# Altium schematic sheet 32.SchDoc
size 513 x 386 mm
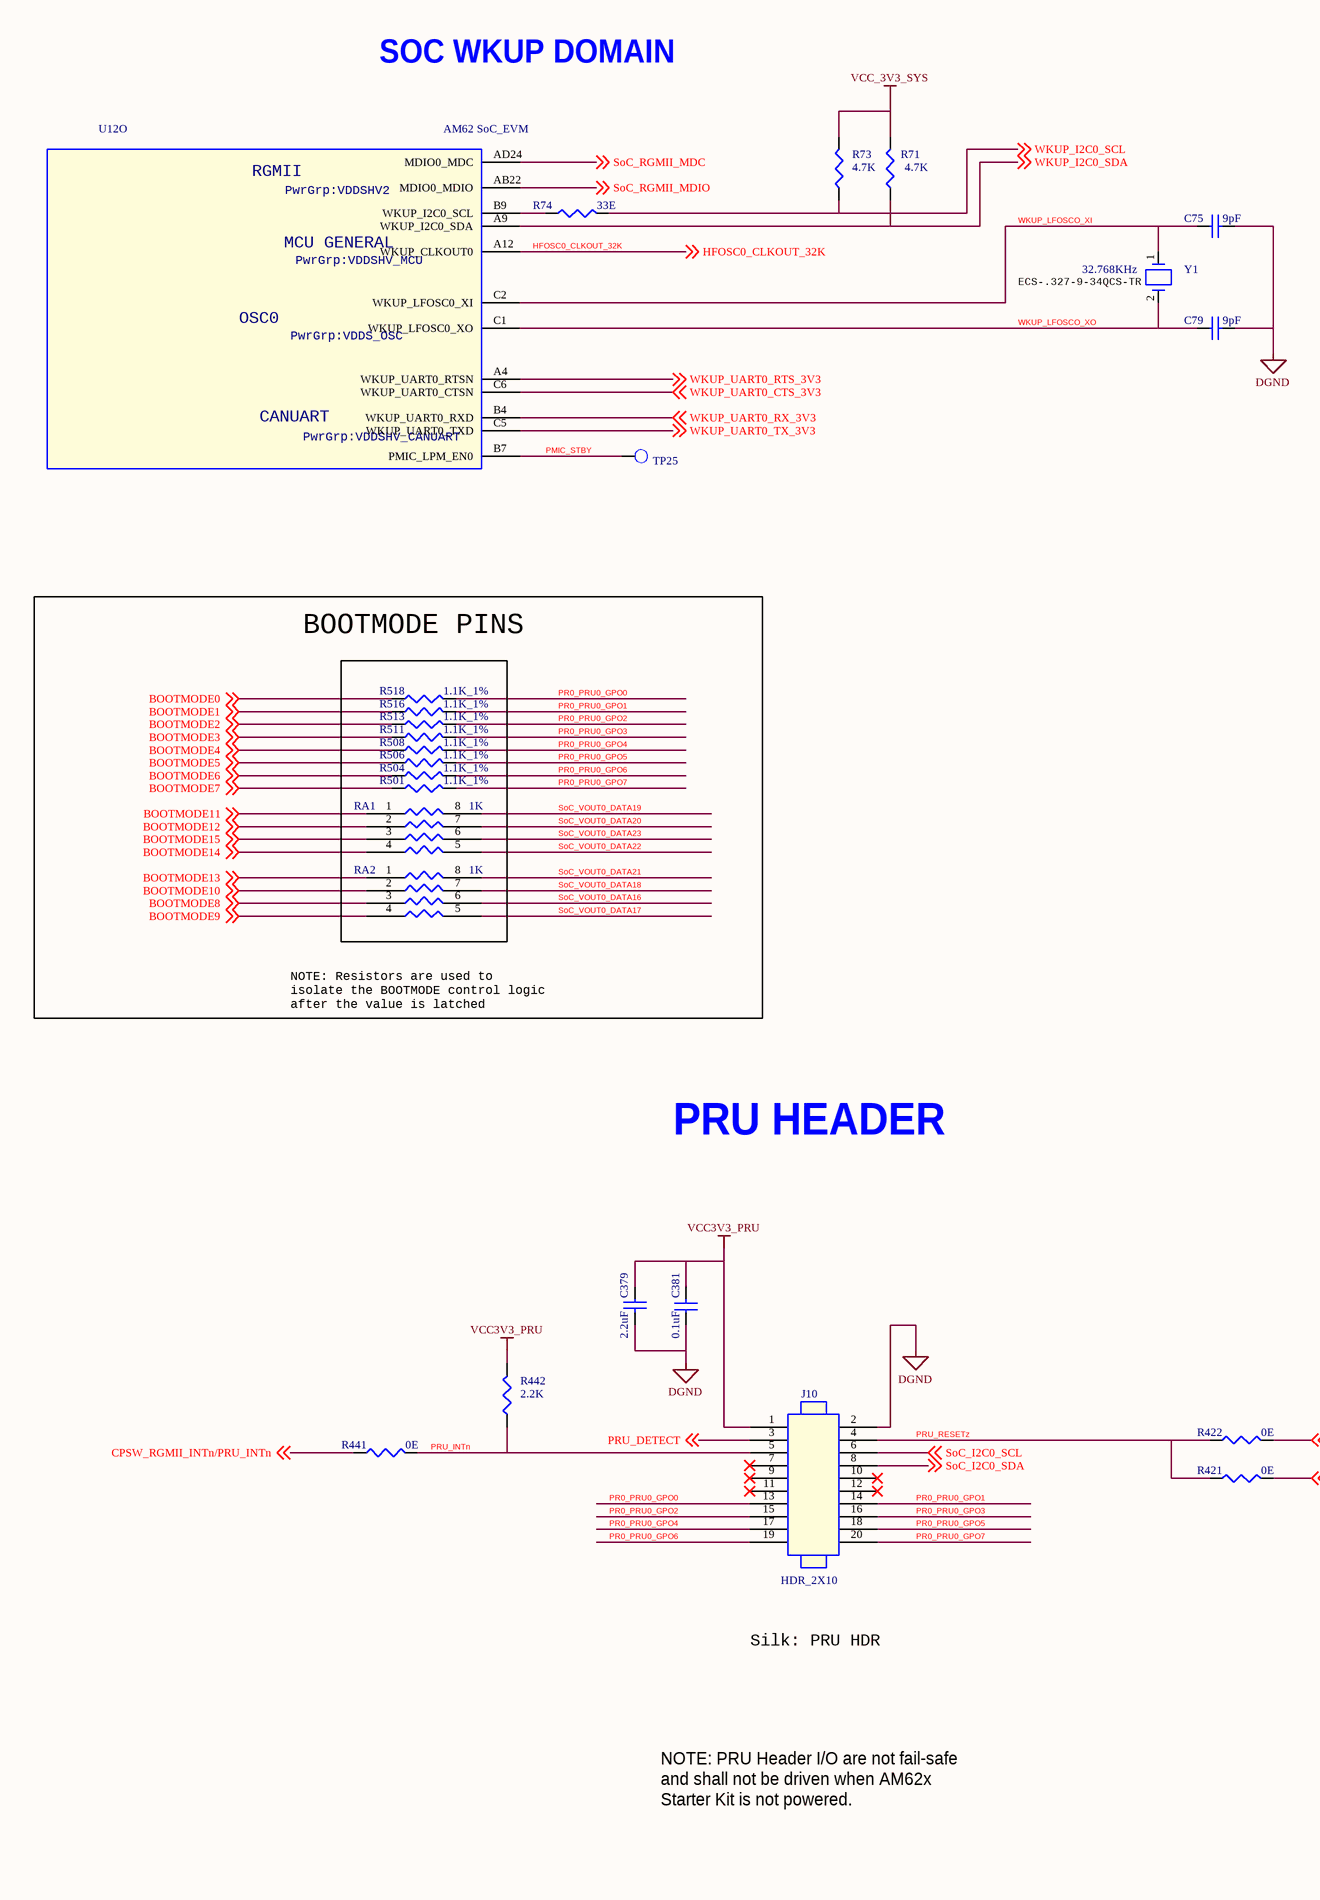
[diagram p0: 32.SchDoc, left]
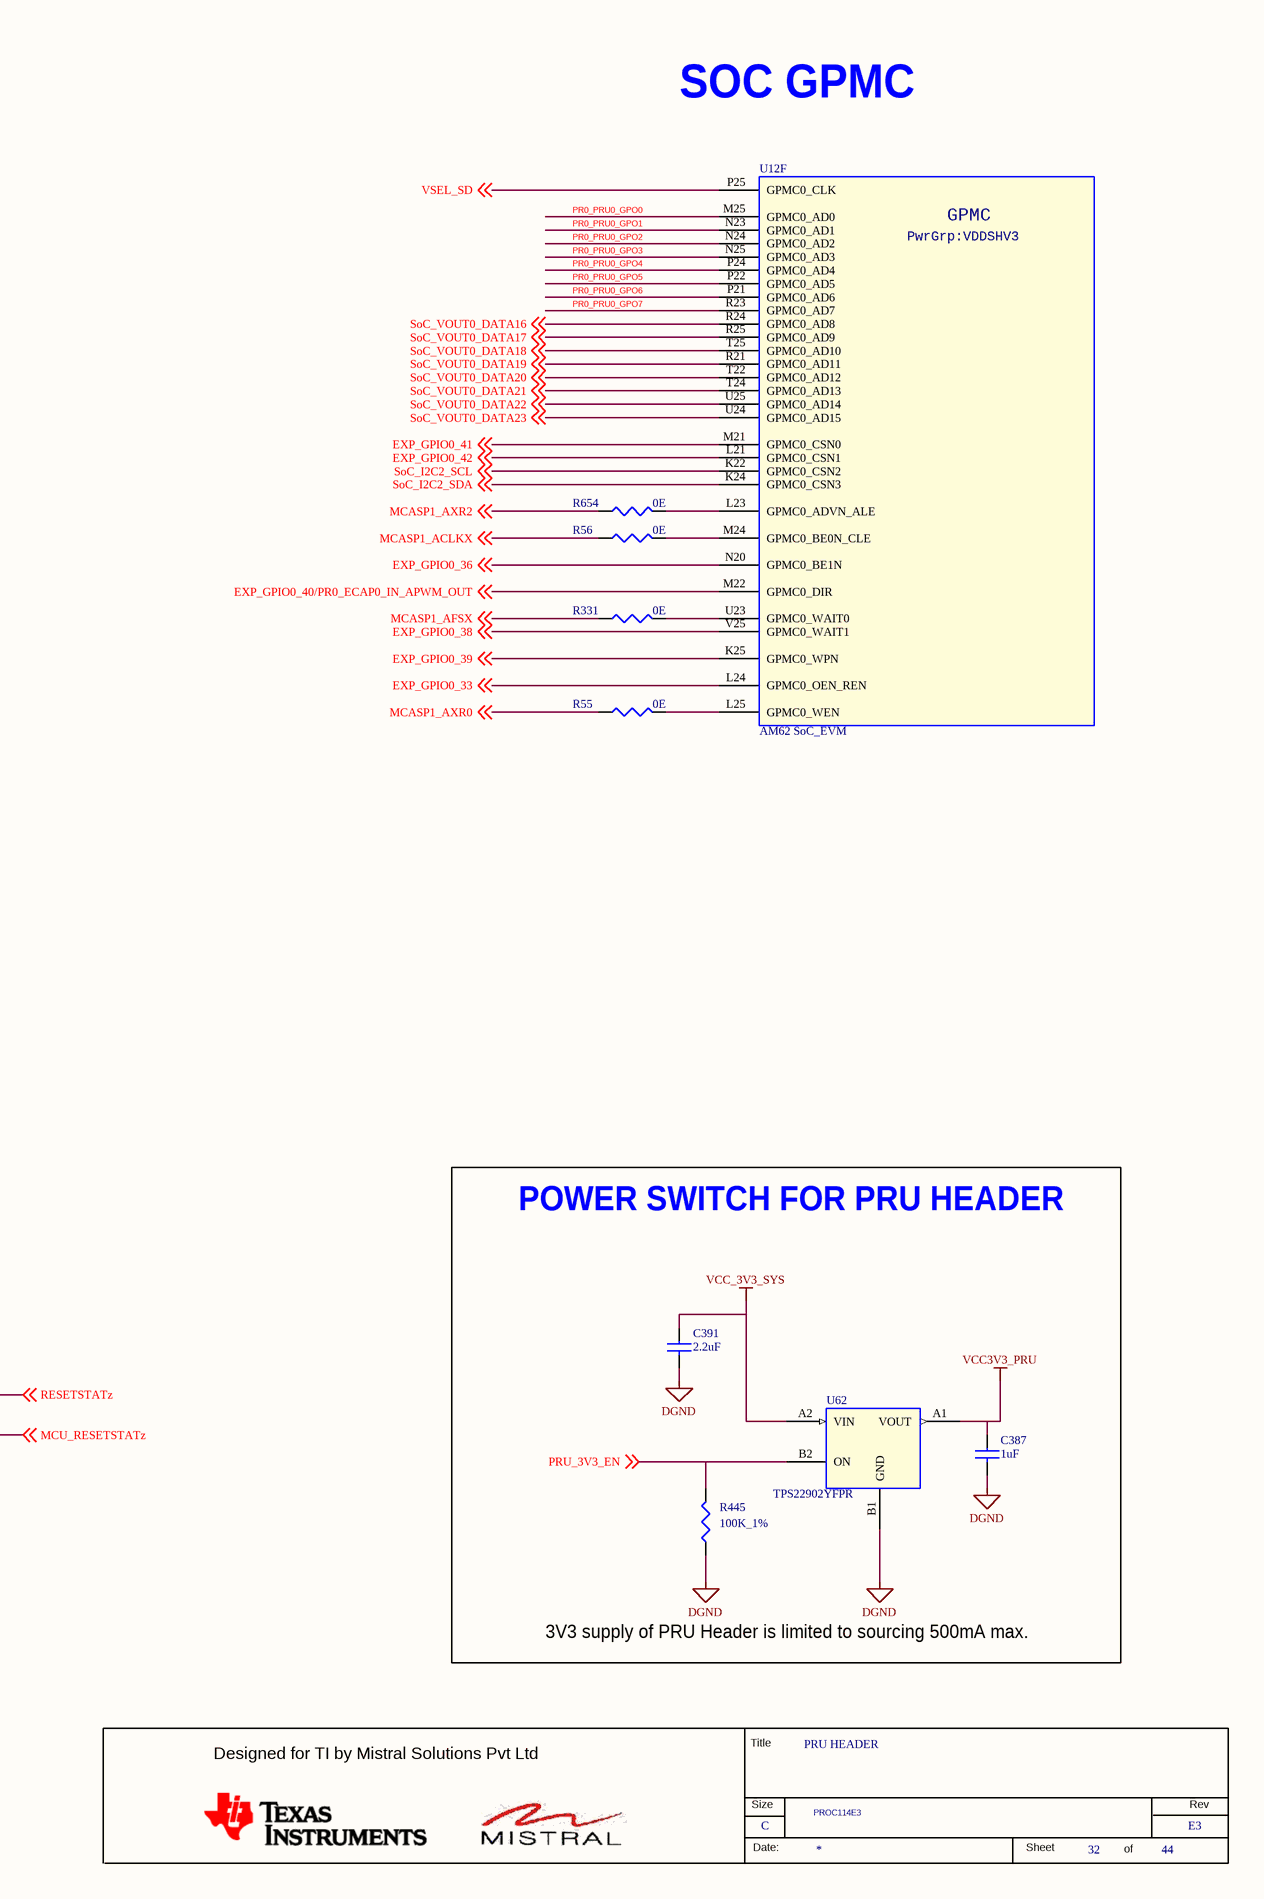
[diagram p1: 32.SchDoc, right]

## Parts
*  RevCode: E3  Title: PRU HEADER  Page Size: C  Page Number: 32  Page Count: 44  Variant Name: PROC114E3  (hidden comment: MISTRAL_TITLEBLK_CSIZE)  (graphical)
C75  9pF  [CAP0402_0-75]
C79  9pF  [CAP0402_0-75]
C379  2.2uF  [CAP0402_0-75]
C381  0.1uF  [CAP0201_0-5]
C387  1uF  [CAP0201_0-5]
C391  2.2uF  [CAP0402_0-75]
J10  HDR_2X10  [HDR_2X10_PREC010DAAN_S_T_8-4]
R55  0E  [RES0201_0-5]
R56  0E  [RES0201_0-5]
R71  4.7K  [RES0201_0-5]
R73  4.7K  [RES0201_0-5]
R74  33E  [RES0201_0-5]
R331  0E  [RES0201_0-5]
R421  0E  [RES0402_0-5]
R422  0E  [RES0201_0-5]
R441  0E  [RES0201_0-5]
R442  2.2K  [RES0201_0-5]
R445  100K_1%  [RES0402_0-5]
R501  1.1K_1%  [RES0201_0-5]
R504  1.1K_1%  [RES0201_0-5]
R506  1.1K_1%  [RES0201_0-5]
R508  1.1K_1%  [RES0201_0-5]
R511  1.1K_1%  [RES0201_0-5]
R513  1.1K_1%  [RES0201_0-5]
R516  1.1K_1%  [RES0201_0-5]
R518  1.1K_1%  [RES0201_0-5]
R654  0E  [RES0201_0-5]
RA1  1K  [RESA_EXB_0201-4_0-5]
RA2  1K  [RESA_EXB_0201-4_0-5]
TP25  TP20_SMD  [TP20_SMD]  (value not drawn)
U12  AM62 SoC_EVM  [BGA425_19-68_510X510_0-7]  (parts F,O of 18)
U62  TPS22902YFPR  [DSBGA4_15-74_30X30_0-5]
Y1  32.768KHz  [XTAL_ECS-32_130X60_SMD_0-9]

## Blocks framed on the sheet
BOOTMODE PINS: R501 R504 R506 R508 R511 R513 R516 R518 RA1 RA2
POWER SWITCH FOR PRU HEADER: C387 C391 R445 U62

## Nets
DGND: C75.2 C79.2 C379.2 C381.1 C387.2 C391.2 J10.2 R445.1 U62.B1(GND)
VCC3V3_PRU: C379.1 C381.2 C387.1 J10.1 R442.1 U62.A1(VOUT)
VCC_3V3_SYS: C391.1 R71.1 R73.1 U62.A2(VIN)
BOOTMODE0: R518.1 ; off-sheet BOOTMODE0
BOOTMODE1: R516.1 ; off-sheet BOOTMODE1
BOOTMODE2: R513.1 ; off-sheet BOOTMODE2
BOOTMODE3: R511.1 ; off-sheet BOOTMODE3
BOOTMODE4: R508.1 ; off-sheet BOOTMODE4
BOOTMODE5: R506.1 ; off-sheet BOOTMODE5
BOOTMODE6: R504.1 ; off-sheet BOOTMODE6
BOOTMODE7: R501.1 ; off-sheet BOOTMODE7
BOOTMODE8: RA2.3 ; off-sheet BOOTMODE8
BOOTMODE9: RA2.4 ; off-sheet BOOTMODE9
BOOTMODE10: RA2.2 ; off-sheet BOOTMODE10
BOOTMODE11: RA1.1 ; off-sheet BOOTMODE11
BOOTMODE12: RA1.2 ; off-sheet BOOTMODE12
BOOTMODE13: RA2.1 ; off-sheet BOOTMODE13
BOOTMODE14: RA1.4 ; off-sheet BOOTMODE14
BOOTMODE15: RA1.3 ; off-sheet BOOTMODE15
CPSW_RGMII_INTn/PRU_INTn: R441.1 ; off-sheet CPSW_RGMII_INTn/PRU_INTn
EXP_GPIO0_33: U12.L24(GPMC0_OEN_REN) ; off-sheet EXP_GPIO0_33
EXP_GPIO0_36: U12.N20(GPMC0_BE1N) ; off-sheet EXP_GPIO0_36
EXP_GPIO0_38: U12.V25(GPMC0_WAIT1) ; off-sheet EXP_GPIO0_38
EXP_GPIO0_39: U12.K25(GPMC0_WPN) ; off-sheet EXP_GPIO0_39
EXP_GPIO0_40/PR0_ECAP0_IN_APWM_OUT: U12.M22(GPMC0_DIR) ; off-sheet EXP_GPIO0_40/PR0_ECAP0_IN_APWM_OUT
EXP_GPIO0_41: U12.M21(GPMC0_CSN0) ; off-sheet EXP_GPIO0_41
EXP_GPIO0_42: U12.L21(GPMC0_CSN1) ; off-sheet EXP_GPIO0_42
HFOSC0_CLKOUT_32K: U12.A12(WKUP_CLKOUT0) ; off-sheet HFOSC0_CLKOUT_32K
MCASP1_ACLKX: R56.1 ; off-sheet MCASP1_ACLKX
MCASP1_AFSX: R331.1 ; off-sheet MCASP1_AFSX
MCASP1_AXR0: R55.1 ; off-sheet MCASP1_AXR0
MCASP1_AXR2: R654.1 ; off-sheet MCASP1_AXR2
MCU_RESETSTATz: R421.1 ; off-sheet MCU_RESETSTATz
PMIC_STBY: TP25.1(TP) U12.B7(PMIC_LPM_EN0)
PR0_PRU0_GPO0: J10.13 R518.2 U12.M25(GPMC0_AD0)
PR0_PRU0_GPO1: J10.14 R516.2 U12.N23(GPMC0_AD1)
PR0_PRU0_GPO2: J10.15 R513.2 U12.N24(GPMC0_AD2)
PR0_PRU0_GPO3: J10.16 R511.2 U12.N25(GPMC0_AD3)
PR0_PRU0_GPO4: J10.17 R508.2 U12.P24(GPMC0_AD4)
PR0_PRU0_GPO5: J10.18 R506.2 U12.P22(GPMC0_AD5)
PR0_PRU0_GPO6: J10.19 R504.2 U12.P21(GPMC0_AD6)
PR0_PRU0_GPO7: J10.20 R501.2 U12.R23(GPMC0_AD7)
PRU_3V3_EN: R445.2 U62.B2(ON) ; off-sheet PRU_3V3_EN
PRU_DETECT: J10.3 ; off-sheet PRU_DETECT
PRU_INTn: J10.5 R441.2 R442.2
PRU_RESETz: J10.4 R421.2 R422.2
RESETSTATz: R422.1 ; off-sheet RESETSTATz
SoC_I2C0_SCL: J10.6 ; off-sheet SoC_I2C0_SCL
SoC_I2C0_SDA: J10.8 ; off-sheet SoC_I2C0_SDA
SoC_I2C2_SCL: U12.K22(GPMC0_CSN2) ; off-sheet SoC_I2C2_SCL
SoC_I2C2_SDA: U12.K24(GPMC0_CSN3) ; off-sheet SoC_I2C2_SDA
SoC_RGMII_MDC: U12.AD24(MDIO0_MDC) ; off-sheet SoC_RGMII_MDC
SoC_RGMII_MDIO: U12.AB22(MDIO0_MDIO) ; off-sheet SoC_RGMII_MDIO
SoC_VOUT0_DATA16: RA2.6 U12.R24(GPMC0_AD8) ; off-sheet SoC_VOUT0_DATA16
SoC_VOUT0_DATA17: RA2.5 U12.R25(GPMC0_AD9) ; off-sheet SoC_VOUT0_DATA17
SoC_VOUT0_DATA18: RA2.7 U12.T25(GPMC0_AD10) ; off-sheet SoC_VOUT0_DATA18
SoC_VOUT0_DATA19: RA1.8 U12.R21(GPMC0_AD11) ; off-sheet SoC_VOUT0_DATA19
SoC_VOUT0_DATA20: RA1.7 U12.T22(GPMC0_AD12) ; off-sheet SoC_VOUT0_DATA20
SoC_VOUT0_DATA21: RA2.8 U12.T24(GPMC0_AD13) ; off-sheet SoC_VOUT0_DATA21
SoC_VOUT0_DATA22: RA1.5 U12.U25(GPMC0_AD14) ; off-sheet SoC_VOUT0_DATA22
SoC_VOUT0_DATA23: RA1.6 U12.U24(GPMC0_AD15) ; off-sheet SoC_VOUT0_DATA23
VSEL_SD: U12.P25(GPMC0_CLK) ; off-sheet VSEL_SD
WKUP_I2C0_SCL: R73.2 R74.2 ; off-sheet WKUP_I2C0_SCL
WKUP_I2C0_SDA: R71.2 U12.A9(WKUP_I2C0_SDA) ; off-sheet WKUP_I2C0_SDA
WKUP_LFOSCO_XI: C75.1 U12.C2(WKUP_LFOSC0_XI) Y1.1
WKUP_LFOSCO_XO: C79.1 U12.C1(WKUP_LFOSC0_XO) Y1.2
WKUP_UART0_CTS_3V3: U12.C6(WKUP_UART0_CTSN) ; off-sheet WKUP_UART0_CTS_3V3
WKUP_UART0_RTS_3V3: U12.A4(WKUP_UART0_RTSN) ; off-sheet WKUP_UART0_RTS_3V3
WKUP_UART0_RX_3V3: U12.B4(WKUP_UART0_RXD) ; off-sheet WKUP_UART0_RX_3V3
WKUP_UART0_TX_3V3: U12.C5(WKUP_UART0_TXD) ; off-sheet WKUP_UART0_TX_3V3
NetR55_2: R55.2 U12.L25(GPMC0_WEN)
NetR56_2: R56.2 U12.M24(GPMC0_BE0N_CLE)
NetR74_1: R74.1 U12.B9(WKUP_I2C0_SCL)
NetR331_2: R331.2 U12.U23(GPMC0_WAIT0)
NetR654_2: R654.2 U12.L23(GPMC0_ADVN_ALE)

Not connected (* = marked no-connect by the designer): J10 7* 9* 10* 11* 12*

## Notes on the sheet
- SOC WKUP DOMAIN
- SOC GPMC
- (near Y1) ECS-.327-9-34QCS-TR
- NOTE: Resistors are used to
  isolate the BOOTMODE control logic
  after the value is latched
- PRU HEADER
- Silk: PRU HDR
- 3V3 supply of PRU Header is limited to sourcing 500mA max.
- NOTE: PRU Header I/O are not fail-safe
  and shall not be driven when AM62x
  Starter Kit is not powered.
- (in symbol AM62-EVM_BGA425, part F) GPMC; PwrGrp:VDDSHV3
- (in symbol AM62-EVM_BGA425, part O) RGMII; PwrGrp:VDDSHV2; MCU GENERAL; PwrGrp:VDDSHV_MCU; OSC0; PwrGrp:VDDS_OSC; CANUART; PwrGrp:VDDSHV_CANUART
- (in symbol MISTRAL_TITLEBLK_CSIZE) Title; Designed for TI by Mistral Solutions Pvt Ltd; Size; Rev; Date:; Sheet; of

## Library data of the parts
* = MISTRAL_TITLEBLK_CSIZE: Issue: 1.0; Page Create Date: March  8, 1995; Page Modify Date: *; Schematic Page Count: 44; Schematic Page Number: 32
C75 = CAP_Dup2: CAP CERAMIC 9pF 50V 0.5pF HI-Q C0G(NP0) 0402; Part_type: CAPACITORS\CERAMIC; Mfr_part_number: GJM1555C1H9R0DB01D; Mfr_name: MURATA; Mistral Part No: 120021090005-R; Custom_Duty: 15%; Customs_HS_Code: 85322990; Wattage: NA; Tolerance: 0.5pF%; Project: TI_AM62x SKEVM_BRD; Footprint Path: Y:\MIS_DATABASE\Library\ALTIUM_TOOL\PCB_FOOTPRINTS\Altium_Footprint_Lib.PcbLib; Library Path: Y:\MIS_DATABASE\Library\ALTIUM_TOOL\SCHEMATICS_PARTS\MS_DISCRETE_Library.schlib; MECHANICAL 3D STEP FILE: CAP0402_0-75; Chkd/date: MANIRAJA/160921; Crtd /date: ALVY/150921; Datasheet: Y:\MIS_DATABASE\DATASHEETS\CAPACITORS\GJM1555C1H9R0DB01.PDF; Temperature: -55°C+125°C; Weight: 1.5mg; Height: 0.55MM; Footprint Ref: CAP0402_0-75; Library Ref: CAP; Distributor_part_number: 490-14793-1-ND; Distributor_name: DIGIKEY; Package: 0402; Voltage: 50V; PCB Footprint: CAP0402_0-75
C79 = CAP_Dup2: CAP CERAMIC 9pF 50V 0.5pF HI-Q C0G(NP0) 0402; Mistral Part No: 120021090005-R; Mfr_name: MURATA; Mfr_part_number: GJM1555C1H9R0DB01D; Part_type: CAPACITORS\CERAMIC; Project: TI_AM62x SKEVM_BRD; Tolerance: 0.5pF%; Wattage: NA; Customs_HS_Code: 85322990; Custom_Duty: 15%; Voltage: 50V; Package: 0402; Distributor_name: DIGIKEY; Distributor_part_number: 490-14793-1-ND; Library Ref: CAP; Footprint Ref: CAP0402_0-75; Height: 0.55MM; Weight: 1.5mg; Temperature: -55°C+125°C; Datasheet: Y:\MIS_DATABASE\DATASHEETS\CAPACITORS\GJM1555C1H9R0DB01.PDF; Crtd /date: ALVY/150921; Chkd/date: MANIRAJA/160921; MECHANICAL 3D STEP FILE: CAP0402_0-75; Library Path: Y:\MIS_DATABASE\Library\ALTIUM_TOOL\SCHEMATICS_PARTS\MS_DISCRETE_Library.schlib; Footprint Path: Y:\MIS_DATABASE\Library\ALTIUM_TOOL\PCB_FOOTPRINTS\Altium_Footprint_Lib.PcbLib; PCB Footprint: CAP0402_0-75
C379 C391 = CAP: CAP CERAMIC 2.2uF 25V 10% X5R 0402; Part_type: CAPACITORS\CERAMIC; Mfr_part_number: GRM155R61E225KE11D; Mfr_name: MURATA; Mistral Part No: 120015120001-R; Custom_Duty: 15%; Customs_HS_Code: 85322990; Wattage: NA; Project: TI_AM263X_CC; Footprint Path: Y:\MIS_DATABASE\Library\ALTIUM_TOOL\PCB_FOOTPRINTS\Altium_Footprint_Lib.PcbLib; Library Path: Y:\MIS_DATABASE\Library\ALTIUM_TOOL\SCHEMATICS_PARTS\MS_DISCRETE_Library.schlib; MECHANICAL 3D STEP FILE: CAP0402_0-75; Chkd/date: ALVY/010721; Crtd /date: MANIRAJA/010721; Datasheet: Y:\MIS_DATABASE\DATASHEETS\CAPACITORS\GRM155R61E225KE11.PDF; Temperature: -55°C+85°C; Weight: 1.5mg; Height: 0.70MM; Library Ref: CAP; Distributor_part_number: 490-12703-1-ND; Distributor_name: DIGIKEY; Package: 0402; Voltage: 25V; Tolerance: 10%; Footprint Ref: CAP0402_0-75; PCB Footprint: CAP0402_0-75
C381 = CAP_Dup2: CAP CERAMIC 0.1uF 16V 10% X5R 0201; Alt_Mfr_name: YAGEO AMERICA; Part_type: CAPACITORS\CERAMIC; Mfr_part_number: GRM033R61C104KE14D; Mfr_name: MURATA; Mistral Part No: 120009030072-R; Alt_Mfr_part_number: CC0402KRX5R8BB104; Custom_Duty: 15%; Customs_HS_Code: 85322990; Wattage: NA; Project: TI_MAXIE_CPB; Footprint Path: Y:\MIS_DATABASE\Library\ALTIUM_TOOL\PCB_FOOTPRINTS\Altium_Footprint_Lib.PcbLib; Library Path: Y:\MIS_DATABASE\Library\ALTIUM_TOOL\SCHEMATICS_PARTS\MS_DISCRETE_Library.schlib; Footprint Ref: CAP0201_0-5; Library Ref: CAP; MECHANICAL 3D STEP FILE: CAP0201_0-5; Chkd/date: MANIRAJA/230118; Crtd /date: MANIRAJA/230118; Datasheet: Y:\MIS_DATABASE\DATASHEETS\CAPACITORS\GRM033R61C104KE14.PDF; Temperature: -55°C+85°C; Weight: 0.33mg; Height: 0.33MM; Distributor_part_number: 490-14305-1-ND; Distributor_name: DIGIKEY; Package: 0201; Voltage: 16V; Tolerance: 10%; PCB Footprint: CAP0201_0-5
C387 = CAP_Dup2: CAP CERAMIC 1uF 16V 20% X5R 0201; Part_type: CAPACITORS\CERAMIC; Mfr_part_number: GRM033R61C105ME15D; Mfr_name: MURATA; Mistral Part No: 120018090038-R; Custom_Duty: 15%; Customs_HS_Code: 85322990; Wattage: NA; Project: QCS610_NANOSOM; Footprint Path: Y:\MIS_DATABASE\Library\ALTIUM_TOOL\PCB_FOOTPRINTS\Altium_Footprint_Lib.PcbLib; Library Path: Y:\MIS_DATABASE\Library\ALTIUM_TOOL\SCHEMATICS_PARTS\MS_DISCRETE_Library.schlib; Footprint Ref: CAP0201_0-5; Chkd/date: MANIRAJA/300520; Crtd /date: ALVY/260520; Datasheet: Y:\MIS_DATABASE\DATASHEETS\CAPACITORS\GRM033R61C105ME15.PDF; Temperature: -55°C+85°C; Weight: 0.33mg; Height: 0.39MM; Distributor_part_number: 490-18654-1-ND; Distributor_name: DIGIKEY; Package: 0201; Voltage: 16V; Tolerance: 20%; MECHANICAL 3D STEP FILE: CAP0201_0-5; Library Ref: CAP; PCB Footprint: CAP0201_0-5
J10 = HEADER_10X2: CON HDR 2X10 2.54MM PITCH ST TH; Mistral Part No: 150021070022-R; Mfr_name: SULLINS CONNECTOR; Mfr_part_number: PREC010DAAN-RC; Part_type: CONNECTOR\HEADERS; Project: TI_AM335x SK_BRD; Tolerance: NA; Customs_HS_Code: 85369090; Custom_Duty: 24%; Footprint Ref: HDR_2X10_PREC010DAAN_S_T_8-4; Voltage: NA; Wattage: NA; Package: THRU-HOLE; Distributor_name: DIGIKEY; Distributor_part_number: S2012EC-10-ND; Library Ref: HEADER_10X2; Height: 8.34MM; Weight: NA; Temperature: -40°C+105°C; Datasheet: Y:\MIS_DATABASE\DATASHEETS\CONNECTORS\PRPCXXDXXN-SER.PDF; Crtd /date: ALVY/260721; Chkd/date: MANIRAJA/270721; MECHANICAL 3D STEP FILE: HDR_2X10_PREC010DAAN_S_T_8-4; Library Path: Y:\MIS_DATABASE\Library\ALTIUM_TOOL\SCHEMATICS_PARTS\MS_CONNECTOR_Library.schlib; Footprint Path: Y:\MIS_DATABASE\Library\ALTIUM_TOOL\PCB_FOOTPRINTS\Altium_Footprint_Lib.PcbLib; PCB Footprint: HDR_2X10_PREC010DAAN_S_T_8-4
R55 R331 = RESISTOR_Dup6: RES 0E 1/20W 5% 0201; Part_type: RESISTORS\FIXED; Mfr_part_number: RC0201JR-070RL; Mfr_name: YAGEO AMERICA; Mistral Part No: 110010070067-R; SIGNAL_MODEL: RESISTOR_RES0201_0-5_0E_0E; Custom_Duty: 15%; Customs_HS_Code: 85332119; Voltage: NA; Project: PB_BUGBASE; PCB Footprint: RES0201_0-5; Footprint Path: Y:\MIS_DATABASE\Library\ALTIUM_TOOL\PCB_FOOTPRINTS\Altium_Footprint_Lib.PcbLib; Library Path: Y:\MIS_DATABASE\Library\ALTIUM_TOOL\SCHEMATICS_PARTS\MS_DISCRETE_Library.schlib; MECHANICAL 3D STEP FILE: RES0201_0-5; Chkd/date: NAVEED/301214; Crtd /date: MUDDU/120710; Datasheet: Y:\MIS_DATABASE\DATASHEETS\RESISTORS\RCXXXXL-SER_MAR18.PDF; Temperature: -55°C+125°C; Weight: 0.17mg; Height: 0.26MM; Library Ref: RESISTOR; Distributor_part_number: 311-0.0NCT-ND; Distributor_name: DIGIKEY; Package: 0201; Wattage: 1/20W; Tolerance: 5%; Footprint Ref: RES0201_0-5
R56 = RESISTOR_Dup6: RES 0E 1/20W 5% 0201; Part_type: RESISTORS\FIXED; Mfr_part_number: RC0201JR-070RL; Mfr_name: YAGEO AMERICA; Mistral Part No: 110010070067-R; Custom_Duty: 15%; Customs_HS_Code: 85332119; Voltage: NA; Project: PB_BUGBASE; PCB Footprint: RES0201_0-5; Footprint Path: Y:\MIS_DATABASE\Library\ALTIUM_TOOL\PCB_FOOTPRINTS\Altium_Footprint_Lib.PcbLib; Library Path: Y:\MIS_DATABASE\Library\ALTIUM_TOOL\SCHEMATICS_PARTS\MS_DISCRETE_Library.schlib; MECHANICAL 3D STEP FILE: RES0201_0-5; Chkd/date: NAVEED/301214; Crtd /date: MUDDU/120710; Datasheet: Y:\MIS_DATABASE\DATASHEETS\RESISTORS\RCXXXXL-SER_MAR18.PDF; Temperature: -55°C+125°C; Weight: 0.17mg; Height: 0.26MM; Library Ref: RESISTOR; Distributor_part_number: 311-0.0NCT-ND; Distributor_name: DIGIKEY; Package: 0201; Wattage: 1/20W; Tolerance: 5%; Footprint Ref: RES0201_0-5
R71 = RESISTOR_Dup6: RES 4.7K 1/20W 5% 0201; Part_type: RESISTORS\FIXED; Mfr_part_number: RC0201JR-074K7L; Mfr_name: YAGEO AMERICA; Mistral Part No: 110021090007-R; Custom_Duty: 15%; Customs_HS_Code: 85332119; Voltage: NA; Project: TI_AM62x SKEVM_BRD; Footprint Path: Y:\MIS_DATABASE\Library\ALTIUM_TOOL\PCB_FOOTPRINTS\Altium_Footprint_Lib.PcbLib; Library Path: Y:\MIS_DATABASE\Library\ALTIUM_TOOL\SCHEMATICS_PARTS\MS_DISCRETE_Library.schlib; MECHANICAL 3D STEP FILE: RES0201_0-5; Chkd/date: MANIRAJA/200921; Crtd /date: ALVY/200921; Datasheet: Y:\MIS_DATABASE\DATASHEETS\RESISTORS\RCXXXXL-SER_MAR18.PDF; Temperature: -55°C+125°C; Weight: 0.17mg; Height: 0.26MM; Library Ref: RESISTOR; Distributor_part_number: 311-4.7KNCT-ND; Distributor_name: DIGIKEY; Package: 0201; Wattage: 1/20W; Tolerance: 5%; Footprint Ref: RES0201_0-5; PCB Footprint: RES0201_0-5
R73 = RESISTOR_Dup6: RES 4.7K 1/20W 5% 0201; Mistral Part No: 110021090007-R; Mfr_name: YAGEO AMERICA; Mfr_part_number: RC0201JR-074K7L; Part_type: RESISTORS\FIXED; Project: TI_AM62x SKEVM_BRD; Voltage: NA; Customs_HS_Code: 85332119; Custom_Duty: 15%; Footprint Ref: RES0201_0-5; Tolerance: 5%; Wattage: 1/20W; Package: 0201; Distributor_name: DIGIKEY; Distributor_part_number: 311-4.7KNCT-ND; Library Ref: RESISTOR; Height: 0.26MM; Weight: 0.17mg; Temperature: -55°C+125°C; Datasheet: Y:\MIS_DATABASE\DATASHEETS\RESISTORS\RCXXXXL-SER_MAR18.PDF; Crtd /date: ALVY/200921; Chkd/date: MANIRAJA/200921; MECHANICAL 3D STEP FILE: RES0201_0-5; Library Path: Y:\MIS_DATABASE\Library\ALTIUM_TOOL\SCHEMATICS_PARTS\MS_DISCRETE_Library.schlib; Footprint Path: Y:\MIS_DATABASE\Library\ALTIUM_TOOL\PCB_FOOTPRINTS\Altium_Footprint_Lib.PcbLib; PCB Footprint: RES0201_0-5
R74 = RESISTOR_Dup6: RES 33E 1/20W 5% 0201; Mistral Part No: 110010070052-R; Mfr_name: PANASONIC-ECG; Mfr_part_number: ERJ-1GNJ330C; Part_type: RESISTORS\FIXED; Project: TI_AM62x_SKEVM_BRD; Voltage: NA; Customs_HS_Code: 85332119; Custom_Duty: 15%; Footprint Ref: RES0201_0-5; Tolerance: 5%; Wattage: 1/20W; Package: 0201; Distributor_name: DIGIKEY; Distributor_part_number: P123303CT-ND; Library Ref: RESISTOR; Height: 0.26MM; Weight: 0.15mg; Temperature: -55°C+125°C; Datasheet: Y:\MIS_DATABASE\DATASHEETS\RESISTORS\PAN-ERJSER_NOV17.PDF; Crtd /date: TAMILARASU/070422; Chkd/date: ALVY/070422; MECHANICAL 3D STEP FILE: RES0201_0-5; Library Path: Y:\MIS_DATABASE\Library\ALTIUM_TOOL\SCHEMATICS_PARTS\MS_DISCRETE_Library.schlib; Footprint Path: Y:\MIS_DATABASE\Library\ALTIUM_TOOL\PCB_FOOTPRINTS\Altium_Footprint_Lib.PcbLib; PCB Footprint: RES0201_0-5
R421 = RESISTOR_Dup4: RES 0E 1/16W JUMPER 0402; Mistral Part No: 110010080019-R; Mfr_name: VISHAY; Mfr_part_number: CRCW04020000Z0ED; Part_type: RESISTORS\FIXED; Project: PB_BUGBASE; Tolerance: NA; Customs_HS_Code: 85332119; Custom_Duty: 15%; Footprint Path: Y:\MIS_DATABASE\Library\ALTIUM_TOOL\PCB_FOOTPRINTS\Altium_Footprint_Lib.PcbLib; Library Path: Y:\MIS_DATABASE\Library\ALTIUM_TOOL\SCHEMATICS_PARTS\MS_DISCRETE_Library.schlib; Footprint Ref: RES0402_0-5; Library Ref: RESISTOR; Voltage: NA; Wattage: 1/16W; Package: 0402; Distributor_name: DIGIKEY; Distributor_part_number: 541-0.0JCT-ND; Height: 0.40MM; Weight: 0.65mg; Temperature: -55°C+155°C; Datasheet: Y:\MIS_DATABASE\DATASHEETS\RESISTORS\CRCW0603.PDF; Crtd /date: MUDDU/190810; Chkd/date: VASANTHA/201216; MECHANICAL 3D STEP FILE: RES0402_0-5; PCB Footprint: RES0402_0-5
R422 = RESISTOR_Dup4: RES 0E 1/20W 5% 0201; Mistral Part No: 110010070067-R; Mfr_name: YAGEO AMERICA; Mfr_part_number: RC0201JR-070RL; Part_type: RESISTORS\FIXED; Project: PB_BUGBASE; Voltage: NA; Customs_HS_Code: 85332119; Custom_Duty: 15%; Footprint Path: Y:\MIS_DATABASE\Library\ALTIUM_TOOL\PCB_FOOTPRINTS\Altium_Footprint_Lib.PcbLib; Library Path: Y:\MIS_DATABASE\Library\ALTIUM_TOOL\SCHEMATICS_PARTS\MS_DISCRETE_Library.schlib; Footprint Ref: RES0201_0-5; Library Ref: RESISTOR; Tolerance: 5%; Wattage: 1/20W; Package: 0201; Distributor_name: DIGIKEY; Distributor_part_number: 311-0.0NCT-ND; Height: 0.26MM; Weight: 0.17mg; Temperature: -55°C+125°C; Datasheet: Y:\MIS_DATABASE\DATASHEETS\RESISTORS\RCXXXXL-SER_MAR18.PDF; Crtd /date: MUDDU/120710; Chkd/date: NAVEED/301214; MECHANICAL 3D STEP FILE: RES0201_0-5; PCB Footprint: RES0201_0-5
R441 = RESISTOR_Dup4: RES 0E 1/20W 5% 0201; Part_type: RESISTORS\FIXED; Mfr_part_number: RC0201JR-070RL; Mfr_name: YAGEO AMERICA; Mistral Part No: 110010070067-R; Custom_Duty: 15%; Customs_HS_Code: 85332119; Voltage: NA; Project: PB_BUGBASE; MECHANICAL 3D STEP FILE: RES0201_0-5; Chkd/date: NAVEED/301214; Crtd /date: MUDDU/120710; Datasheet: Y:\MIS_DATABASE\DATASHEETS\RESISTORS\RCXXXXL-SER_MAR18.PDF; Temperature: -55°C+125°C; Weight: 0.17mg; Height: 0.26MM; Distributor_part_number: 311-0.0NCT-ND; Distributor_name: DIGIKEY; Package: 0201; Wattage: 1/20W; Tolerance: 5%; Library Ref: RESISTOR; Footprint Ref: RES0201_0-5; Library Path: Y:\MIS_DATABASE\Library\ALTIUM_TOOL\SCHEMATICS_PARTS\MS_DISCRETE_Library.schlib; Footprint Path: Y:\MIS_DATABASE\Library\ALTIUM_TOOL\PCB_FOOTPRINTS\Altium_Footprint_Lib.PcbLib; PCB Footprint: RES0201_0-5
R442 = RESISTOR_Dup6: RES 2.2K 1/20W 5% 0201; Mistral Part No: 110009030427-R; Mfr_name: PANASONIC-ECG; Mfr_part_number: ERJ-1GEJ222C; Part_type: RESISTORS\FIXED; Project: G4SLIM; Voltage: NA; Customs_HS_Code: 85332119; Custom_Duty: 15%; Footprint Ref: RES0201_0-5; Tolerance: 5%; Wattage: 1/20W; Package: 0201; Distributor_name: DIGIKEY; Distributor_part_number: P2.2KAGCT-ND; Library Ref: RESISTOR; Height: 0.26MM; Weight: 0.15mg; Temperature: -55°C+125°C; Datasheet: Y:\MIS_DATABASE\DATASHEETS\RESISTORS\PAN-ERJXGE-FEB06.PDF; Crtd /date: MAZHAR/010605; Chkd/date: VASANTHA/010117; MECHANICAL 3D STEP FILE: RES0201_0-5; Library Path: Y:\MIS_DATABASE\Library\ALTIUM_TOOL\SCHEMATICS_PARTS\MS_DISCRETE_Library.schlib; Footprint Path: Y:\MIS_DATABASE\Library\ALTIUM_TOOL\PCB_FOOTPRINTS\Altium_Footprint_Lib.PcbLib; PCB Footprint: RES0201_0-5
R445 = RESISTOR_Dup6: RES 100K 1/10W 1% 0402; Part_type: RESISTORS\FIXED; Mfr_part_number: ERJ-2RKF1003X; Mfr_name: PANASONIC-ECG; Mistral Part No: 110009030187-R; Custom_Duty: 15%; Customs_HS_Code: 85332119; Voltage: NA; Project: J32; Footprint Path: Y:\MIS_DATABASE\Library\ALTIUM_TOOL\PCB_FOOTPRINTS\Altium_Footprint_Lib.PcbLib; Library Path: Y:\MIS_DATABASE\Library\ALTIUM_TOOL\SCHEMATICS_PARTS\MS_DISCRETE_Library.schlib; MECHANICAL 3D STEP FILE: RES0402_0-5; Chkd/date: VASANTHA/201216; Crtd /date: MAZHAR/130306; Datasheet: Y:\MIS_DATABASE\DATASHEETS\RESISTORS\PAN-ERJSER_NOV17.PDF; Temperature: -55°C+155°C; Weight: 0.8mg; Height: 0.40MM; Library Ref: RESISTOR; Distributor_part_number: P100KLCT-ND; Distributor_name: DIGIKEY; Package: 0402; Wattage: 1/10W; Tolerance: 1%; Footprint Ref: RES0402_0-5; PCB Footprint: RES0402_0-5
R501 R504 R506 R508 R511 R513 R516 = RESISTOR_Dup6: RES 1.1K 1/20W 1% 0201; Mistral Part No: 110021090018-R; Mfr_name: STACKPOLE ELECTRONICS; Mfr_part_number: RMCF0201FT1K10; Part_type: RESISTORS\FIXED; Project: TI_AM335x SK_BRD; Voltage: NA; Customs_HS_Code: 85332119; Custom_Duty: 15%; Tolerance: 1%; Wattage: 1/20W; Package: 0201; Distributor_name: DIGIKEY; Distributor_part_number: RMCF0201FT1K10CT-ND; Library Ref: RESISTOR; Footprint Ref: RES0201_0-5; Height: 0.26MM; Weight: 0.16mg; Temperature: -55°C+155°C; Datasheet: Y:\MIS_DATABASE\DATASHEETS\RESISTORS\RMCF-SER_JUL18.PDF; Crtd /date: ALVY/280921; Chkd/date: MANIRAJA/290921; MECHANICAL 3D STEP FILE: RES0201_0-5; Library Path: Y:\MIS_DATABASE\Library\ALTIUM_TOOL\SCHEMATICS_PARTS\MS_DISCRETE_Library.schlib; Footprint Path: Y:\MIS_DATABASE\Library\ALTIUM_TOOL\PCB_FOOTPRINTS\Altium_Footprint_Lib.PcbLib; PCB Footprint: RES0201_0-5
R518 = RESISTOR_Dup6: RES 1.1K 1/20W 1% 0201; Part_type: RESISTORS\FIXED; Mfr_part_number: RMCF0201FT1K10; Mfr_name: STACKPOLE ELECTRONICS; Mistral Part No: 110021090018-R; Custom_Duty: 15%; Customs_HS_Code: 85332119; Voltage: NA; Project: TI_AM335x SK_BRD; Footprint Path: Y:\MIS_DATABASE\Library\ALTIUM_TOOL\PCB_FOOTPRINTS\Altium_Footprint_Lib.PcbLib; Library Path: Y:\MIS_DATABASE\Library\ALTIUM_TOOL\SCHEMATICS_PARTS\MS_DISCRETE_Library.schlib; MECHANICAL 3D STEP FILE: RES0201_0-5; Chkd/date: MANIRAJA/290921; Crtd /date: ALVY/280921; Datasheet: Y:\MIS_DATABASE\DATASHEETS\RESISTORS\RMCF-SER_JUL18.PDF; Temperature: -55°C+155°C; Weight: 0.16mg; Height: 0.26MM; Footprint Ref: RES0201_0-5; Library Ref: RESISTOR; Distributor_part_number: RMCF0201FT1K10CT-ND; Distributor_name: DIGIKEY; Package: 0201; Wattage: 1/20W; Tolerance: 1%; PCB Footprint: RES0201_0-5
R654 = RESISTOR_Dup6: RES 0E 1/20W 5% 0201; Mistral Part No: 110010070067-R; Mfr_name: YAGEO AMERICA; Mfr_part_number: RC0201JR-070RL; Part_type: RESISTORS\FIXED; Project: PB_BUGBASE; Voltage: NA; Customs_HS_Code: 85332119; Custom_Duty: 15%; SIGNAL_MODEL: RESISTOR_RES0201_0-5_0E_0E; PCB Footprint: RES0201_0-5; Footprint Ref: RES0201_0-5; Tolerance: 5%; Wattage: 1/20W; Package: 0201; Distributor_name: DIGIKEY; Distributor_part_number: 311-0.0NCT-ND; Library Ref: RESISTOR; Height: 0.26MM; Weight: 0.17mg; Temperature: -55°C+125°C; Datasheet: Y:\MIS_DATABASE\DATASHEETS\RESISTORS\RCXXXXL-SER_MAR18.PDF; Crtd /date: MUDDU/120710; Chkd/date: NAVEED/301214; MECHANICAL 3D STEP FILE: RES0201_0-5; Library Path: Y:\MIS_DATABASE\Library\ALTIUM_TOOL\SCHEMATICS_PARTS\MS_DISCRETE_Library.schlib; Footprint Path: Y:\MIS_DATABASE\Library\ALTIUM_TOOL\PCB_FOOTPRINTS\Altium_Footprint_Lib.PcbLib
RA1 = RESARR_ISO4: RES ARRAY 1K 31mW 5% 0201-4; Part_type: RESISTORS\ARRAY; Mfr_part_number: EXB-18V102JX; Manufacturer: PANASONIC-ECG; Mistral Part No: 110015050003-R; Custom_Duty: 15%; Customs_HS_Code: 85332119; Voltage: NA; Project: FREE SCALE NANO; PCB Footprint: RESA_EXB_0201-4_0-5; Footprint Path: Y:\MIS_DATABASE\Library\ALTIUM_TOOL\PCB_FOOTPRINTS\Altium_Footprint_Lib.PcbLib; Library Path: Y:\MIS_DATABASE\Library\ALTIUM_TOOL\SCHEMATICS_PARTS\MS_DISCRETE_Library.schlib; MECHANICAL 3D STEP FILE: RESA_EXB_0201-4_0-5; Chkd/date: NAVEED/110515; Crtd /date: VASANTHA/080515; Datasheet: Y:\MIS_DATABASE\DATASHEETS\RESISTORS\EXB-18V.PDF; Temperature: -55°C+125°C; Weight: 1mg; Height: 0.45MM; Library Ref: RESARR_ISO4; Distributor_part_number: Y6102CT-ND; Distributor_name: DIGIKEY; Package: 0201-4; Wattage: 31mW; Tolerance: 5%; Footprint Ref: RESA_EXB_0201-4_0-5
RA2 = RESARR_ISO4: RES ARRAY 1K 31mW 5% 0201-4; Mistral Part No: 110015050003-R; Manufacturer: PANASONIC-ECG; Mfr_part_number: EXB-18V102JX; Part_type: RESISTORS\ARRAY; Project: FREE SCALE NANO; Voltage: NA; Customs_HS_Code: 85332119; Custom_Duty: 15%; PCB Footprint: RESA_EXB_0201-4_0-5; Footprint Ref: RESA_EXB_0201-4_0-5; Tolerance: 5%; Wattage: 31mW; Package: 0201-4; Distributor_name: DIGIKEY; Distributor_part_number: Y6102CT-ND; Library Ref: RESARR_ISO4; Height: 0.45MM; Weight: 1mg; Temperature: -55°C+125°C; Datasheet: Y:\MIS_DATABASE\DATASHEETS\RESISTORS\EXB-18V.PDF; Crtd /date: VASANTHA/080515; Chkd/date: NAVEED/110515; MECHANICAL 3D STEP FILE: RESA_EXB_0201-4_0-5; Library Path: Y:\MIS_DATABASE\Library\ALTIUM_TOOL\SCHEMATICS_PARTS\MS_DISCRETE_Library.schlib; Footprint Path: Y:\MIS_DATABASE\Library\ALTIUM_TOOL\PCB_FOOTPRINTS\Altium_Footprint_Lib.PcbLib
TP25 = TESTPOINT: TESTPOINT CIR 20 SMD; Mistral Part No: NA; Mfr_name: LOCAL; Project: BT MODULE_CSRBC04; RoHS: NA; Mfr_part_number: TP20_SMD; Part_type: TESTPOINT; Package: SMD; Distributor_name: NA; Distributor_part_number: NA; Height: NA; Crtd /date: MAZHAR/171006; Chkd/date: SHREESHAIL/171006; Tolerance: NA; Voltage: NA; Wattage: NA; Weight: NA; Temperature: NA; Datasheet: NA; MECHANICAL 3D STEP FILE: NA; Library Path: Y:\MIS_DATABASE\Library\ALTIUM_TOOL\SCHEMATICS_PARTS\MS_DISCRETE_Library.schlib; Footprint Path: Y:\MIS_DATABASE\Library\ALTIUM_TOOL\PCB_FOOTPRINTS\Altium_Footprint_Lib.PcbLib; Library Ref: TESTPOINT; Footprint Ref: TP20_SMD; Customs_HS_Code: NA; Custom_Duty: NA; PCB Footprint: TP20_SMD
U12 = AM62-EVM_BGA425: IC AM62 SoC MICROPROCESSOR BGA425; Mistral Part No: 141221060001; Mfr_name: TEXAS INSTRUMENTS; Part_type: ICS\DIGITAL\MICROPROCESSOR; Project: AM62_EVM_BRD; Tolerance: NA; Customs_HS_Code: 85423100; Custom_Duty: 15%; Mfr_part_number: AM62 SoC_EVM; Voltage: NA; Wattage: NA; Package: BGA425; Distributor_name: NA; Distributor_part_number: NA; Library Ref: AM62-EVM_BGA425; Footprint Ref: BGA425_19-68_510X510_0-7; Height: 0.65MM; Weight: NA; Temperature: NA; Datasheet: Y:\MIS_DATABASE\DATASHEETS\ICS\DIGITAL\MICROCONTROLLER\AM62-SoC_SVB.PDF; Crtd /date: MANIRAJA/110621; Chkd/date: ALVY/110621; RoHS: NA; MECHANICAL 3D STEP FILE: BGA425_19-68_510X510_0-7; Library Path: Y:\MIS_DATABASE\Library\ALTIUM_TOOL\SCHEMATICS_PARTS\MS_MICROPROCESSOR_Library.schlib; Footprint Path: Y:\MIS_DATABASE\Library\ALTIUM_TOOL\PCB_FOOTPRINTS\Altium_Footprint_Lib.PcbLib; PCB Footprint: BGA425_19-68_510X510_0-7
U62 = TPS22912CYZVR_DSBGA4: IC 3.6V 500mA 78mE ON-RESISTANCE LOAD SWITCH WITH CONTROLLED TURNON DSBGA4; Mistral Part No: 142020090007-R; Mfr_name: TEXAS INSTRUMENTS; Part_type: ICS\POWER; Project: AM64X_SKEVM; Tolerance: NA; Customs_HS_Code: 85423100; Custom_Duty: 15%; Footprint Ref: DSBGA4_15-74_30X30_0-5; Mfr_part_number: TPS22902YFPR; Voltage: NA; Wattage: NA; Package: DSBGA4; Distributor_name: DIGIKEY; Distributor_part_number: 296-24472-1-ND; Library Ref: TPS22912CYZVR_DSBGA4; Height: 0.50MM; Weight: 0.7mg; Temperature: -40°C+85°C; Datasheet: Y:\MIS_DATABASE\DATASHEETS\ICS\POWER\TPS22901-2-3.PDF; Crtd /date: ALVY/160920; Chkd/date: MANIRAJA/170920; MECHANICAL 3D STEP FILE: DSBGA4_15-74_30X30_0-5; Library Path: Y:\MIS_DATABASE\Library\ALTIUM_TOOL\SCHEMATICS_PARTS\MS_MISCPOWER_Library.schlib; Footprint Path: Y:\MIS_DATABASE\Library\ALTIUM_TOOL\PCB_FOOTPRINTS\Altium_Footprint_Lib.PcbLib; PCB Footprint: DSBGA4_15-74_30X30_0-5
Y1 = CRY: CRY 32.768KHz 9pF SMD; Part_type: CRYSTAL; Mfr_part_number: ECS-.327-9-34QCS-TR; Mfr_name: ECS INC; Mistral Part No: 130019040003-R; Custom_Duty: 24%; Customs_HS_Code: 85439000; Wattage: NA; Project: J7ES_SOM_DUAL-LEO_PMIC; Footprint Path: Y:\MIS_DATABASE\Library\ALTIUM_TOOL\PCB_FOOTPRINTS\Altium_Footprint_Lib.PcbLib; Library Path: Y:\MIS_DATABASE\Library\ALTIUM_TOOL\SCHEMATICS_PARTS\MS_DISCRETE_Library.schlib; MECHANICAL 3D STEP FILE: XTAL_ECS-32_130X60_SMD_0-9; Chkd/date: VASANTHA/090419; Crtd /date: ALVY/090419; Datasheet: Y:\MIS_DATABASE\DATASHEETS\MISC\CRY_OSC\ECS-34Q.PDF; Temperature: -40°C+125°C; Weight: 16mg; Height: 0.90MM; Footprint Ref: XTAL_ECS-32_130X60_SMD_0-9; Library Ref: CRY; Distributor_part_number: XC2160CT-ND; Distributor_name: DIGIKEY; Package: SMD; Voltage: NA; Tolerance: NA; PCB Footprint: XTAL_ECS-32_130X60_SMD_0-9